# Altium schematic sheet DC-DC.SchDoc
size A4; SheetNumber: 3; SheetTotal: 4
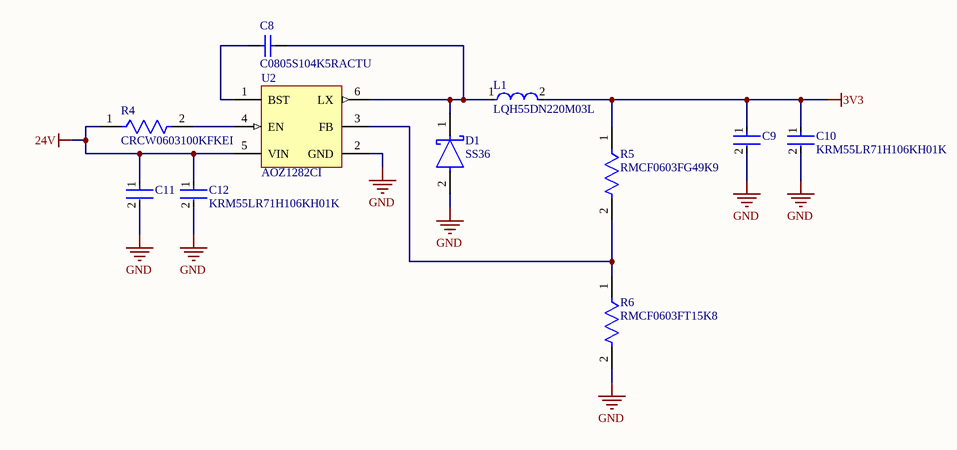
[diagram p0: DC-DC.SchDoc]

## Parts
C8  C0805S104K5RACTU  [CAPC2013X145X50NL20T25]
C9  KRM55LR71H106KH01K  [FP-KRM55L-6_1_5_3_3_1_2-C-MFG]  (value not drawn)
C10  KRM55LR71H106KH01K  [FP-KRM55L-6_1_5_3_3_1_2-C-MFG]
C11  KRM55LR71H106KH01K  [FP-KRM55L-6_1_5_3_3_1_2-C-MFG]  (value not drawn)
C12  KRM55LR71H106KH01K  [FP-KRM55L-6_1_5_3_3_1_2-C-MFG]
D1  SS36  [FP-403AG-MFG]
L1  LQH55DN220M03L  [FP-LQH55DN_03-MFG]
R4  CRCW0603100KFKEI  [FP-CRCW0603-e3-MFG]
R5  RMCF0603FG49K9  [FP-RMCF0603-MFG]
R6  RMCF0603FT15K8  [FP-RMCF0603-IPC_B]
U2  AOZ1282CI  [AO-SOT23-6L-6_V]

## Nets
3V3: C9.1 C10.1 L1.2 R5.1
24V: C11.1 C12.1 R4.1 U2.5(VIN)
GND: C9.2 C10.2 C11.2 C12.2 D1.2(A) R6.2 U2.2(GND)
NetC8_1: C8.1 U2.1(BST)
NetC8_2: C8.2 D1.1(C) L1.1 U2.6(LX)
NetR4_2: R4.2 U2.4(EN)
NetR5_2: R5.2 R6.1 U2.3(FB)

## Library data of the parts
C8 = CMP-2007-01227-1: 100 nF 50 VDC X7R 10 % 0805; Manufacturer: Kemet; Part Number: C0805S104K5RACTU
C9-C12 = CMP-06035-010592-1: Cap Ceramic Multilayer 10uF 50V ±10% 2220 Emboss T/R
D1 = CMP-07162-000004-1: DIODE SCHOTTKY 60V 3A SMC; Manufacturer: ON Semiconductor; Max Junction Temp: +150°C; Max Surge Forward Current: 100A; Standoff Height: 0.05mm; Peak Reverse Current: 0.5mA; Description: Diode Schottky 60V 3A Surface Mount SMC (DO-214AB); Manufacturer Part Number: SS36; Category: Diode; Device Class L2: Diodes; Lead Free: Yes; Mouser Description: In a Pack of 25, ON Semi 60V 3A, Schottky Diode, 2-Pin DO-214AB SS36; Automotive: No; Package: 403AG; Device Class L3: Schottky Diodes; Footprint Url: https://www.onsemi.com/pub/Collateral/403AG.PDF; Temperature: -55°C to +150°C; ComponentLink2URL: https://www.onsemi.com/pub/Collateral/SS39-D.PDF; Max Repetitive Reverse Voltage: 60V; Octopart: https://octopart.com/ss36-on+semiconductor-84331627; Temperature Range Low: -55°C; Forward Current: 3A; Device Class L1: Discrete Semiconductors; Digikey Description: DIODE SCHOTTKY 60V 3A SMC; RoHS: TRUE; Temperature Range High: +150°C; ComponentLink2Description: Datasheet; Height: 2.65mm
L1 = CMP-06042-011077-1: Wire Wound Ferrite Inductor for Power Lines 22μH ±20% 0.266Ω  1.2A 2220; Shielding: Unshielded; Inductance: 22uH; Test Frequency: 1MHz; DC Resistance (DCR): 190mR; Self Resonant Frequency: 15MHz; Current Rating: 1.2A; Length: 5.7mm; Military Standard: Not; Package Quantity: 350; Case/Package: 2220; Core Material: Ferrite; Radiation Hardening: No; DC Current: 1.2A; Tolerance: 20%; Inductance Tolerance: 20%; Height - Seated (Max): 0.198inch; Packaging: Tape and Reel; Weight: 0.016932oz; Termination: SMD/SMT; Lead Free: Lead Free; Width: 6mm; Case Code (Metric): 5750; Depth: 5.3mm; Resistor Type: Wirewound; Max Operating Temperature: 80°C; Max DC Current: 1.2A; Height: 4.7mm; Case Code (Imperial): 2220; REACH SVHC: No SVHC; Min Operating Temperature: -25°C; Mount: Surface Mount; Series Resistance: 190mR
R4 = CMP-02407-005189-1: RES Thick Film, 100kΩ, 1%, 0.1W, 100ppm/°C, 0603; Resistance: 100kR; Max Power Dissipation: 100mW; Number of Terminations: 2; Temperature Coefficient: 100ppm/°C; Composition: Thick Film; Max Operating Temperature: 155°C; Packaging: Tape and Reel; Lead Free: Lead Free; Min Operating Temperature: -55°C; Case/Package: 0603; Tolerance: 1%; Height: 0.02inch; Length: 0.061inch; Package Quantity: 5000; Width: 0.033inch; Features: Automotive AEC-Q200
R5 = CMP-26527-006070-1: 49.9kΩ ±1% 0.1W 0603 Thick Film Chip Resistor AEC-Q200 compliant; Resistance: 49.9kR; Temperature Coefficient: 100ppm/°C; Max Power Dissipation: 100mW; Max Operating Temperature: 155°C; Length: 0.061inch; Radiation Hardening: No; Tolerance: 1%; Mount: Surface Mount; Package Quantity: 10000; Number of Terminations: 2; Features: Automotive AEC-Q200; Width: 0.031inch; Packaging: Tape and Reel; Case Code (Metric): 1608; Case/Package: 0603; Series: RMCF; Resistor Type: Thick Film; Min Operating Temperature: -55°C; Height: 0.022inch; RoHS Compliant: Yes; Case Code (Imperial): 0603; Contact Plating: Tin
R6 = CMP-26527-006657-1: 15.8kΩ ±1% 0.1W 0603 Thick Film Chip Resistor AEC-Q200 compliant; Temperature Coefficient: 100ppm/°C; Resistance: 15.8kR; Max Power Dissipation: 100mW; Mount: Surface Mount; Packaging: Tape and Reel; Lead Free: Lead Free; Max Operating Temperature: 155°C; Min Operating Temperature: -55°C; Number of Terminations: 2; Case Code (Imperial): 0603; Radiation Hardening: No; Case Code (Metric): 1608; Length: 0.061inch; Features: Automotive AEC-Q200; Contact Plating: Tin; Series: RMCF; Height: 0.022inch; Resistor Type: Thick Film; Tolerance: 1%; RoHS Compliant: Yes; Case/Package: 0603; Width: 0.031inch
U2 = CMP-2000-05779-1: EZBuck(TM) 1.2 A Simple Buck Regulator, 4.5 to 36 V, -40 to 85 degC, 6-Pin SOT23-6L, RoHS, Tape and Reel; Manufacturer: Alpha and Omega; Synchronous Rectifier: No; Other Related Documents: AOSGreenPolicy; Voltage - Input (Max): 36V; Function: Step-Down; Number of Outputs: 1; Current - Output: 1.2A; Output Configuration: Positive; Voltage - Input (Min): 4.5V; Voltage - Output (Min/Fixed): 0.8V; Other Names: 785-1613-6; Frequency - Switching: 450kHz; Online Catalog: Buck(Step-Down)IC; Output Type: Adjustable; Mounting Type: SurfaceMount; Mounting Technology: SurfaceMount; Datasheet Version: Rev. 1.1, 06/2014; Voltage - Output (Max): 36V; Topology: Buck; Standard Package: 1; Manufacturer URL: http://www.aosmd.com/; Datasheet URL: https://datasheet.ciiva.com/15081/aoz1282ci-15081829.pdf; Series: EZBuck™; Package Reference: SOT23-6L; Family: PMIC-VoltageRegulators-DCDCSwitchingRegulators; Packaging: Digi-Reel®; Package / Case: SOT-23-6; Category: IntegratedCircuits(ICs); Supplier Device Package: SOT-23-6; Package Description: 6-Pin Small Outline Transistor, Body 1.6 x 2.9 mm, Pitch 0.95 mm; Operating Temperature: -40°C~85°C(TA)